# Altium schematic sheet 06.MIPI_CSI_Camera.SchDoc
size A3; CheckedBy: YPC; DocumentNumber: 6; Revision: V1.00; SheetNumber: 06; SheetTotal: 18; SheetName: MIPI_CSI_Camera; SheetDescribe: MIPI_CSI连接器接口子图; Designer: JOW; DesignDate: 2025-04-25; CheckedData: 2025-04-25; Rule: PcbType=ProtelPcb
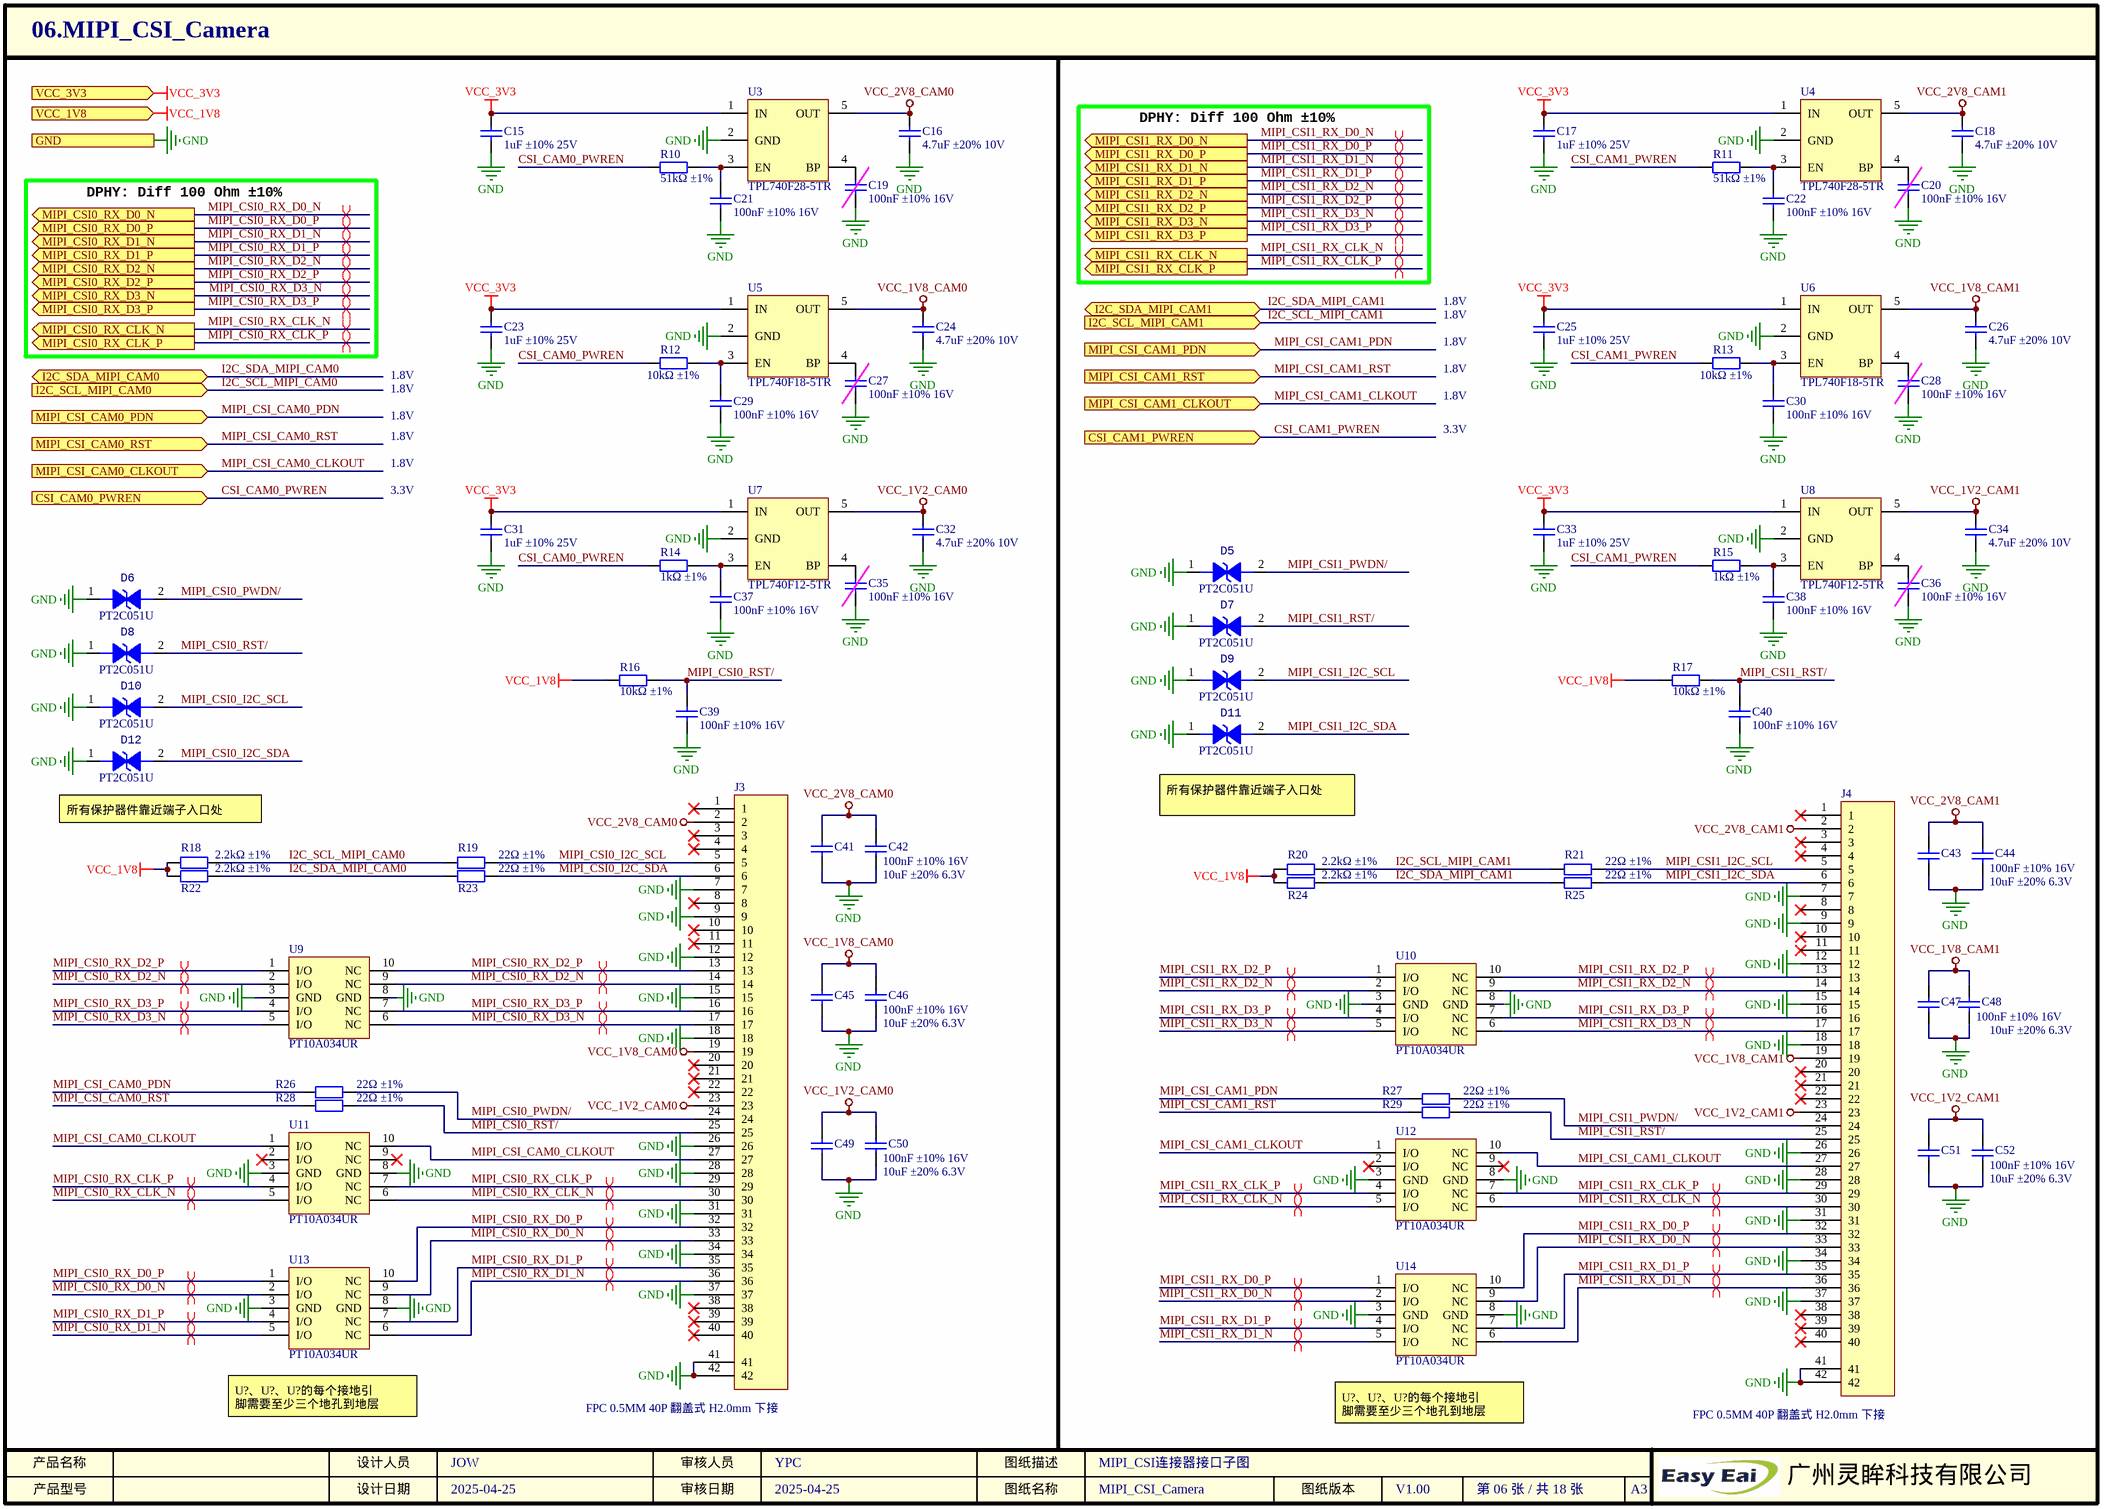
[diagram p0: 06.MIPI_CSI_Camera.SchDoc]

## Parts
C15  描述: 1uF ±10% 25V  [0402_C]  (hidden comment: CL05A105KA5NQNC)
C16  描述: 4.7uF ±20% 10V  [0402_C]  (hidden comment: CL05A475MP5NRNC)
C17  描述: 1uF ±10% 25V  [0402_C]  (hidden comment: CL05A105KA5NQNC)
C18  描述: 4.7uF ±20% 10V  [0402_C]  (hidden comment: CL05A475MP5NRNC)
C19  描述: 100nF ±10% 16V  [0402_C]  (hidden comment: CL05B104KO5NNNC)  (no BOM)
C20  描述: 100nF ±10% 16V  [0402_C]  (hidden comment: CL05B104KO5NNNC)  (no BOM)
C21  描述: 100nF ±10% 16V  [0402_C]  (hidden comment: CL05B104KO5NNNC)
C22  描述: 100nF ±10% 16V  [0402_C]  (hidden comment: CL05B104KO5NNNC)
C23  描述: 1uF ±10% 25V  [0402_C]  (hidden comment: CL05A105KA5NQNC)
C24  描述: 4.7uF ±20% 10V  [0402_C]  (hidden comment: CL05A475MP5NRNC)
C25  描述: 1uF ±10% 25V  [0402_C]  (hidden comment: CL05A105KA5NQNC)
C26  描述: 4.7uF ±20% 10V  [0402_C]  (hidden comment: CL05A475MP5NRNC)
C27  描述: 100nF ±10% 16V  [0402_C]  (hidden comment: CL05B104KO5NNNC)  (no BOM)
C28  描述: 100nF ±10% 16V  [0402_C]  (hidden comment: CL05B104KO5NNNC)  (no BOM)
C29  描述: 100nF ±10% 16V  [0402_C]  (hidden comment: CL05B104KO5NNNC)
C30  描述: 100nF ±10% 16V  [0402_C]  (hidden comment: CL05B104KO5NNNC)
C31  描述: 1uF ±10% 25V  [0402_C]  (hidden comment: CL05A105KA5NQNC)
C32  描述: 4.7uF ±20% 10V  [0402_C]  (hidden comment: CL05A475MP5NRNC)
C33  描述: 1uF ±10% 25V  [0402_C]  (hidden comment: CL05A105KA5NQNC)
C34  描述: 4.7uF ±20% 10V  [0402_C]  (hidden comment: CL05A475MP5NRNC)
C35  描述: 100nF ±10% 16V  [0402_C]  (hidden comment: CL05B104KO5NNNC)  (no BOM)
C36  描述: 100nF ±10% 16V  [0402_C]  (hidden comment: CL05B104KO5NNNC)  (no BOM)
C37  描述: 100nF ±10% 16V  [0402_C]  (hidden comment: CL05B104KO5NNNC)
C38  描述: 100nF ±10% 16V  [0402_C]  (hidden comment: CL05B104KO5NNNC)
C39  描述: 100nF ±10% 16V  [0402_C]  (hidden comment: CL05B104KO5NNNC)
C40  描述: 100nF ±10% 16V  [0402_C]  (hidden comment: CL05B104KO5NNNC)
C41  描述: 10uF ±20% 6.3V  [0402_C]  (hidden comment: CL05A106MQ5NUNC)
C42  描述: 100nF ±10% 16V  [0402_C]  (hidden comment: CL05B104KO5NNNC)
C43  描述: 10uF ±20% 6.3V  [0402_C]  (hidden comment: CL05A106MQ5NUNC)
C44  描述: 100nF ±10% 16V  [0402_C]  (hidden comment: CL05B104KO5NNNC)
C45  描述: 10uF ±20% 6.3V  [0402_C]  (hidden comment: CL05A106MQ5NUNC)
C46  描述: 100nF ±10% 16V  [0402_C]  (hidden comment: CL05B104KO5NNNC)
C47  描述: 10uF ±20% 6.3V  [0402_C]  (hidden comment: CL05A106MQ5NUNC)
C48  描述: 100nF ±10% 16V  [0402_C]  (hidden comment: CL05B104KO5NNNC)
C49  描述: 10uF ±20% 6.3V  [0402_C]  (hidden comment: CL05A106MQ5NUNC)
C50  描述: 100nF ±10% 16V  [0402_C]  (hidden comment: CL05B104KO5NNNC)
C51  描述: 10uF ±20% 6.3V  [0402_C]  (hidden comment: CL05A106MQ5NUNC)
C52  描述: 100nF ±10% 16V  [0402_C]  (hidden comment: CL05B104KO5NNNC)
D5  PT2C051U  [DFN1006]
D6  PT2C051U  [DFN1006]
D7  PT2C051U  [DFN1006]
D8  PT2C051U  [DFN1006]
D9  PT2C051U  [DFN1006]
D10  PT2C051U  [DFN1006]
D11  PT2C051U  [DFN1006]
D12  PT2C051U  [DFN1006]
J3  AFC01-S40FCA-00  [FFC0.5-40P]  (value not drawn)
J4  AFC01-S40FCA-00  [FFC0.5-40P]  (value not drawn)
R10  描述: 51kΩ ±1%  [0402_R]  (hidden comment: 0402WGF5102TCE)
R11  描述: 51kΩ ±1%  [0402_R]  (hidden comment: 0402WGF5102TCE)
R12  描述: 10kΩ ±1%  [0402_R]  (hidden comment: 0402WGF1002TCE)
R13  描述: 10kΩ ±1%  [0402_R]  (hidden comment: 0402WGF1002TCE)
R14  描述: 1kΩ ±1%  [0402_R]  (hidden comment: 0402WGF1001TCE)
R15  描述: 1kΩ ±1%  [0402_R]  (hidden comment: 0402WGF1001TCE)
R16  描述: 10kΩ ±1%  [0402_R]  (hidden comment: 0402WGF1002TCE)
R17  描述: 10kΩ ±1%  [0402_R]  (hidden comment: 0402WGF1002TCE)
R18  描述: 2.2kΩ ±1%  [0402_R]  (hidden comment: AC0402FR-072K2L)
R19  描述: 22Ω ±1%  [0402_R]  (hidden comment: 0402WGF220JTCE)
R20  描述: 2.2kΩ ±1%  [0402_R]  (hidden comment: AC0402FR-072K2L)
R21  描述: 22Ω ±1%  [0402_R]  (hidden comment: 0402WGF220JTCE)
R22  描述: 2.2kΩ ±1%  [0402_R]  (hidden comment: AC0402FR-072K2L)
R23  描述: 22Ω ±1%  [0402_R]  (hidden comment: 0402WGF220JTCE)
R24  描述: 2.2kΩ ±1%  [0402_R]  (hidden comment: AC0402FR-072K2L)
R25  描述: 22Ω ±1%  [0402_R]  (hidden comment: 0402WGF220JTCE)
R26  描述: 22Ω ±1%  [0402_R]  (hidden comment: 0402WGF220JTCE)
R27  描述: 22Ω ±1%  [0402_R]  (hidden comment: 0402WGF220JTCE)
R28  描述: 22Ω ±1%  [0402_R]  (hidden comment: 0402WGF220JTCE)
R29  描述: 22Ω ±1%  [0402_R]  (hidden comment: 0402WGF220JTCE)
U3  TPL740F28-5TR  [SOT-23-5]
U4  TPL740F28-5TR  [SOT-23-5]
U5  TPL740F18-5TR  [SOT-23-5]
U6  TPL740F18-5TR  [SOT-23-5]
U7  TPL740F12-5TR  [SOT-23-5]
U8  TPL740F12-5TR  [SOT-23-5]
U9  PT10A034UR  [DFN2510]
U10  PT10A034UR  [DFN2510]
U11  PT10A034UR  [DFN2510]
U12  PT10A034UR  [DFN2510]
U13  PT10A034UR  [DFN2510]
U14  PT10A034UR  [DFN2510]

## Ports
CSI_CAM0_PWREN (in), CSI_CAM1_PWREN (in), GND, I2C_SCL_MIPI_CAM0 (in), I2C_SCL_MIPI_CAM1 (in), I2C_SDA_MIPI_CAM0 (bidir), I2C_SDA_MIPI_CAM1 (bidir), MIPI_CSI0_RX_CLK_N (out), MIPI_CSI0_RX_CLK_P (out), MIPI_CSI0_RX_D0_N (out), MIPI_CSI0_RX_D0_P (out), MIPI_CSI0_RX_D1_N (out), MIPI_CSI0_RX_D1_P (out), MIPI_CSI0_RX_D2_N (out), MIPI_CSI0_RX_D2_P (out), MIPI_CSI0_RX_D3_N (out), MIPI_CSI0_RX_D3_P (out), MIPI_CSI1_RX_CLK_N (out), MIPI_CSI1_RX_CLK_P (out), MIPI_CSI1_RX_D0_N (out), MIPI_CSI1_RX_D0_P (out), MIPI_CSI1_RX_D1_N (out), MIPI_CSI1_RX_D1_P (out), MIPI_CSI1_RX_D2_N (out), MIPI_CSI1_RX_D2_P (out), MIPI_CSI1_RX_D3_N (out), MIPI_CSI1_RX_D3_P (out), MIPI_CSI_CAM0_CLKOUT (in), MIPI_CSI_CAM0_PDN (in), MIPI_CSI_CAM0_RST (in), MIPI_CSI_CAM1_CLKOUT (in), MIPI_CSI_CAM1_PDN (in), MIPI_CSI_CAM1_RST (in), VCC_1V8 (in), VCC_3V3 (in)

## Nets
GND: C15.1 C16.1 C17.1 C18.1 C19.1 C20.1 C21.1 C22.1 C23.1 C24.1 C25.1 C26.1 C27.1 C28.1 C29.1 C30.1 C31.1 C32.1 C33.1 C34.1 C35.1 C36.1 C37.1 C38.1 C39.1 C40.1 C41.1 C42.1 C43.1 C44.1 C45.1 C46.1 C47.1 C48.1 C49.1 C50.1 C51.1 C52.1 D5.1 D6.1 D7.1 D8.1 D9.1 D10.1 D11.1 D12.1 J3.7 J3.9 J3.12 J3.15 J3.18 J3.26 J3.28 J3.31 J3.34 J3.37 J3.41 J3.42 J4.7 J4.9 J4.12 J4.15 J4.18 J4.26 J4.28 J4.31 J4.34 J4.37 J4.41 J4.42 U3.2(GND) U4.2(GND) U5.2(GND) U6.2(GND) U7.2(GND) U8.2(GND) U9.3(GND) U9.8(GND) U10.3(GND) U10.8(GND) U11.3(GND) U11.8(GND) U12.3(GND) U12.8(GND) U13.3(GND) U13.8(GND) U14.3(GND) U14.8(GND) ; port GND
VCC_1V2_CAM0: C32.2 C49.2 C50.2 J3.23 U7.5(OUT)
VCC_1V2_CAM1: C34.2 C51.2 C52.2 J4.23 U8.5(OUT)
VCC_1V8: R16.2 R17.2 R18.1 R20.1 R22.1 R24.1 ; port VCC_1V8
VCC_1V8_CAM0: C24.2 C45.2 C46.2 J3.19 U5.5(OUT)
VCC_1V8_CAM1: C26.2 C47.2 C48.2 J4.19 U6.5(OUT)
VCC_2V8_CAM0: C16.2 C41.2 C42.2 J3.2 U3.5(OUT)
VCC_2V8_CAM1: C18.2 C43.2 C44.2 J4.2 U4.5(OUT)
VCC_3V3: C15.2 C17.2 C23.2 C25.2 C31.2 C33.2 U3.1(IN) U4.1(IN) U5.1(IN) U6.1(IN) U7.1(IN) U8.1(IN) ; port VCC_3V3
CSI_CAM0_PWREN: R10.1 R12.1 R14.1 ; port CSI_CAM0_PWREN
CSI_CAM1_PWREN: R11.1 R13.1 R15.1 ; port CSI_CAM1_PWREN
I2C_SCL_MIPI_CAM0: R18.2 R19.1 ; port I2C_SCL_MIPI_CAM0
I2C_SCL_MIPI_CAM1: R20.2 R21.1 ; port I2C_SCL_MIPI_CAM1
I2C_SDA_MIPI_CAM0: R22.2 R23.1 ; port I2C_SDA_MIPI_CAM0
I2C_SDA_MIPI_CAM1: R24.2 R25.1 ; port I2C_SDA_MIPI_CAM1
MIPI_CSI0_I2C_SCL: D10.2 J3.5 R19.2
MIPI_CSI0_I2C_SDA: D12.2 J3.6 R23.2
MIPI_CSI0_PWDN/: D6.2 J3.24 R26.2
MIPI_CSI0_RST/: C39.2 D8.2 J3.25 R16.1 R28.2
MIPI_CSI0_RX_CLK_N: J3.30 U11.5(I/O) U11.6(NC) ; port MIPI_CSI0_RX_CLK_N
MIPI_CSI0_RX_CLK_P: J3.29 U11.4(I/O) U11.7(NC) ; port MIPI_CSI0_RX_CLK_P
MIPI_CSI0_RX_D0_N: J3.33 U13.2(I/O) U13.9(NC) ; port MIPI_CSI0_RX_D0_N
MIPI_CSI0_RX_D0_P: J3.32 U13.1(I/O) U13.10(NC) ; port MIPI_CSI0_RX_D0_P
MIPI_CSI0_RX_D1_N: J3.36 U13.5(I/O) U13.6(NC) ; port MIPI_CSI0_RX_D1_N
MIPI_CSI0_RX_D1_P: J3.35 U13.4(I/O) U13.7(NC) ; port MIPI_CSI0_RX_D1_P
MIPI_CSI0_RX_D2_N: J3.14 U9.2(I/O) U9.9(NC) ; port MIPI_CSI0_RX_D2_N
MIPI_CSI0_RX_D2_P: J3.13 U9.1(I/O) U9.10(NC) ; port MIPI_CSI0_RX_D2_P
MIPI_CSI0_RX_D3_N: J3.17 U9.5(I/O) U9.6(NC) ; port MIPI_CSI0_RX_D3_N
MIPI_CSI0_RX_D3_P: J3.16 U9.4(I/O) U9.7(NC) ; port MIPI_CSI0_RX_D3_P
MIPI_CSI1_I2C_SCL: D9.2 J4.5 R21.2
MIPI_CSI1_I2C_SDA: D11.2 J4.6 R25.2
MIPI_CSI1_PWDN/: D5.2 J4.24 R27.2
MIPI_CSI1_RST/: C40.2 D7.2 J4.25 R17.1 R29.2
MIPI_CSI1_RX_CLK_N: J4.30 U12.5(I/O) U12.6(NC) ; port MIPI_CSI1_RX_CLK_N
MIPI_CSI1_RX_CLK_P: J4.29 U12.4(I/O) U12.7(NC) ; port MIPI_CSI1_RX_CLK_P
MIPI_CSI1_RX_D0_N: J4.33 U14.2(I/O) U14.9(NC) ; port MIPI_CSI1_RX_D0_N
MIPI_CSI1_RX_D0_P: J4.32 U14.1(I/O) U14.10(NC) ; port MIPI_CSI1_RX_D0_P
MIPI_CSI1_RX_D1_N: J4.36 U14.5(I/O) U14.6(NC) ; port MIPI_CSI1_RX_D1_N
MIPI_CSI1_RX_D1_P: J4.35 U14.4(I/O) U14.7(NC) ; port MIPI_CSI1_RX_D1_P
MIPI_CSI1_RX_D2_N: J4.14 U10.2(I/O) U10.9(NC) ; port MIPI_CSI1_RX_D2_N
MIPI_CSI1_RX_D2_P: J4.13 U10.1(I/O) U10.10(NC) ; port MIPI_CSI1_RX_D2_P
MIPI_CSI1_RX_D3_N: J4.17 U10.5(I/O) U10.6(NC) ; port MIPI_CSI1_RX_D3_N
MIPI_CSI1_RX_D3_P: J4.16 U10.4(I/O) U10.7(NC) ; port MIPI_CSI1_RX_D3_P
MIPI_CSI_CAM0_CLKOUT: J3.27 U11.1(I/O) U11.10(NC) ; port MIPI_CSI_CAM0_CLKOUT
MIPI_CSI_CAM0_PDN: R26.1 ; port MIPI_CSI_CAM0_PDN
MIPI_CSI_CAM0_RST: R28.1 ; port MIPI_CSI_CAM0_RST
MIPI_CSI_CAM1_CLKOUT: J4.27 U12.1(I/O) U12.10(NC) ; port MIPI_CSI_CAM1_CLKOUT
MIPI_CSI_CAM1_PDN: R27.1 ; port MIPI_CSI_CAM1_PDN
MIPI_CSI_CAM1_RST: R29.1 ; port MIPI_CSI_CAM1_RST
NetC19_2: C19.2 U3.4(BP)
NetC20_2: C20.2 U4.4(BP)
NetC21_2: C21.2 R10.2 U3.3(EN)
NetC22_2: C22.2 R11.2 U4.3(EN)
NetC27_2: C27.2 U5.4(BP)
NetC28_2: C28.2 U6.4(BP)
NetC29_2: C29.2 R12.2 U5.3(EN)
NetC30_2: C30.2 R13.2 U6.3(EN)
NetC35_2: C35.2 U7.4(BP)
NetC36_2: C36.2 U8.4(BP)
NetC37_2: C37.2 R14.2 U7.3(EN)
NetC38_2: C38.2 R15.2 U8.3(EN)

Not connected (* = marked no-connect by the designer): J3 1* 3* 4* 8* 10* 11* 20* 21* 22* 38* 39* 40*; J4 1* 3* 4* 8* 10* 11* 20* 21* 22* 38* 39* 40*; U11 2(I/O)* 9(NC)*; U12 2(I/O)* 9(NC)*

## Layout directives
differential pair: MIPI_CSI0_RX_CLK_N, MIPI_CSI0_RX_CLK_P, MIPI_CSI0_RX_D0_N, MIPI_CSI0_RX_D0_P, MIPI_CSI0_RX_D1_N, MIPI_CSI0_RX_D1_P, MIPI_CSI0_RX_D2_N, MIPI_CSI0_RX_D2_P, MIPI_CSI0_RX_D3_N, MIPI_CSI0_RX_D3_P, MIPI_CSI1_RX_CLK_N, MIPI_CSI1_RX_CLK_P, MIPI_CSI1_RX_D0_N, MIPI_CSI1_RX_D0_P, MIPI_CSI1_RX_D1_N, MIPI_CSI1_RX_D1_P, MIPI_CSI1_RX_D2_N, MIPI_CSI1_RX_D2_P, MIPI_CSI1_RX_D3_N, MIPI_CSI1_RX_D3_P

## Notes on the sheet
- DPHY: Diff 100 Ohm ±10%
- 1.8V
- 3.3V
- 所有保护器件靠近端子入口处
- (near U13) U?、U?、U?的每个接地引
  脚需要至少三个地孔到地层
- (near U14) U?、U?、U?的每个接地引
  脚需要至少三个地孔到地层
- 产品名称
- 产品型号
- 设计人员
- 设计日期
- 审核人员
- 审核日期
- 图纸名称
- 图纸描述
- 图纸版本
- A3
- 广州灵眸科技有限公司

## Library data of the parts
C15 C17 C23 C25 C31 C33 = 0402 1uF ±10% 25V: SPZL000337; 名称: 贴片电容; 厂商: SAMSUNG(三星); 封装: 0402; 工作温度: -55~85℃; 贴片和直插: SMD; 型号: CL05A105KA5NQNC; SuppliersPartNumber: C52923; 商品编号: SPZL000337
C16 C18 C24 C26 C32 C34 = 0402 4.7uF ±20% 10V: SPZL000339; 名称: 贴片电容; 厂商: SAMSUNG(三星); 封装: 0402; 工作温度: -55~85℃; 贴片和直插: SMD; 型号: CL05A475MP5NRNC; SuppliersPartNumber: C23733; 商品编号: SPZL000339
C19-C22 C27-C30 C35-C40 C42 C44 C46 C48 C50 C52 = 0402 100nF ±10% 16V: SPZL000259; 名称: 贴片电容; 厂商: SAMSUNG(三星); 封装: 0402; 工作温度: -55~125℃; 贴片和直插: SMD; 型号: CL05B104KO5NNNC; SuppliersPartNumber: C1525; 商品编号: SPZL000259
C41 C43 C45 C47 C49 C51 = 0402 10uF ±20% 6.3V: SPZL000269; 名称: 贴片电容; 厂商: SAMSUNG(三星); 封装: 0402; 工作温度: -55~85℃; 贴片和直插: SMD; 型号: CL05A106MQ5NUNC; SuppliersPartNumber: C15525; 商品编号: SPZL000269
D5-D12 = PT2C051U: SPZL001147; 名称: ESD; 贴片和直插: SMD; 厂商: 玛珂斯科技; 描述: Vrwm=5V, Cj=0.3pF; 工作温度: -55~125℃; 封装: DFN1006; 商品编号: SPZL001147; 型号: PT2C051U
J3 J4 = FPC 0.5MM 40P 翻盖式 H2.0mm 下接: SPZL000107; 名称: FPC座子; 厂商: JS(钜硕电子); 贴片和直插: SMD; 封装: SMD,P=0.5mm; 工作温度: -25~85℃; SuppliersPartNumber: C262674; 型号: AFC01-S40FCA-00; 商品编号: SPZL000107; 描述: FPC 0.5MM 40P 翻盖式 H2.0mm 下接
R10 R11 = 0402 51kΩ ±1%: SPZL000788; 封装: 0402; 厂商: UNI-ROYAL(厚声); 贴片和直插: SMD; 名称: 电阻; 工作温度: -55~155℃; SuppliersPartNumber: C25794; 型号: 0402WGF5102TCE; 商品编号: SPZL000788
R12 R13 R16 R17 = 0402 10kΩ ±1%: SPZL000271; 封装: 0402; 厂商: UNI-ROYAL(厚声); 贴片和直插: SMD; 名称: 电阻; 工作温度: -55~155℃; SuppliersPartNumber: C25744; 型号: 0402WGF1002TCE; 商品编号: SPZL000271
R14 R15 = 0402 1kΩ ±1%: SPZL000275; 封装: 0402; 厂商: UNI-ROYAL(厚声); 贴片和直插: SMD; 名称: 电阻; 工作温度: -55~125℃; SuppliersPartNumber: C11702; 型号: 0402WGF1001TCE; 商品编号: SPZL000275
R18 R20 R22 R24 = 0402 2.2kΩ ±1%: SPZL000307; 封装: 0402; 厂商: YAGEO(国巨); 贴片和直插: SMD; 名称: 电阻; 工作温度: -55~155℃; SuppliersPartNumber: C144773; 型号: AC0402FR-072K2L; 商品编号: SPZL000307
R19 R21 R23 R25-R29 = 0402 22Ω ±1%: SPZL000279; 封装: 0402; 厂商: UNI-ROYAL(厚声); 贴片和直插: SMD; 名称: 电阻; 工作温度: -55~155℃; SuppliersPartNumber: C25092; 型号: 0402WGF220JTCE; 商品编号: SPZL000279
U3 U4 = TPL740F28-5TR: SPZL000631; 名称: 电源IC; 厂商: 3PEAK; 贴片和直插: SMD; 描述: LDO; 工作温度: -40~85℃; 封装: SOT-23-5; SuppliersPartNumber: *; 商品编号: SPZL000631; 型号: TPL740F28-5TR
U5 U6 = TPL740F18-5TR: SPZL000630; 名称: 电源IC; 厂商: 3PEAK; 贴片和直插: SMD; 描述: LDO; 工作温度: -40~85℃; 封装: SOT-23-5; SuppliersPartNumber: *; 商品编号: SPZL000630; 型号: TPL740F18-5TR
U7 U8 = TPL740F12-5TR: SPZL000632; 名称: 电源IC; 厂商: 3PEAK; 贴片和直插: SMD; 描述: LDO; 工作温度: -40~85℃; 封装: SOT-23-5; SuppliersPartNumber: *; 商品编号: SPZL000632; 型号: TPL740F12-5TR
U9-U14 = PT10A034UR: SPZL001146; 名称: ESD; 厂商: 玛珂斯科技; 贴片和直插: SMD; 描述: Vrwm=3.3V Cj=0.3pF; 工作温度: -55~125℃; 封装: DFN2510; 商品编号: SPZL001146; 型号: PT10A034UR